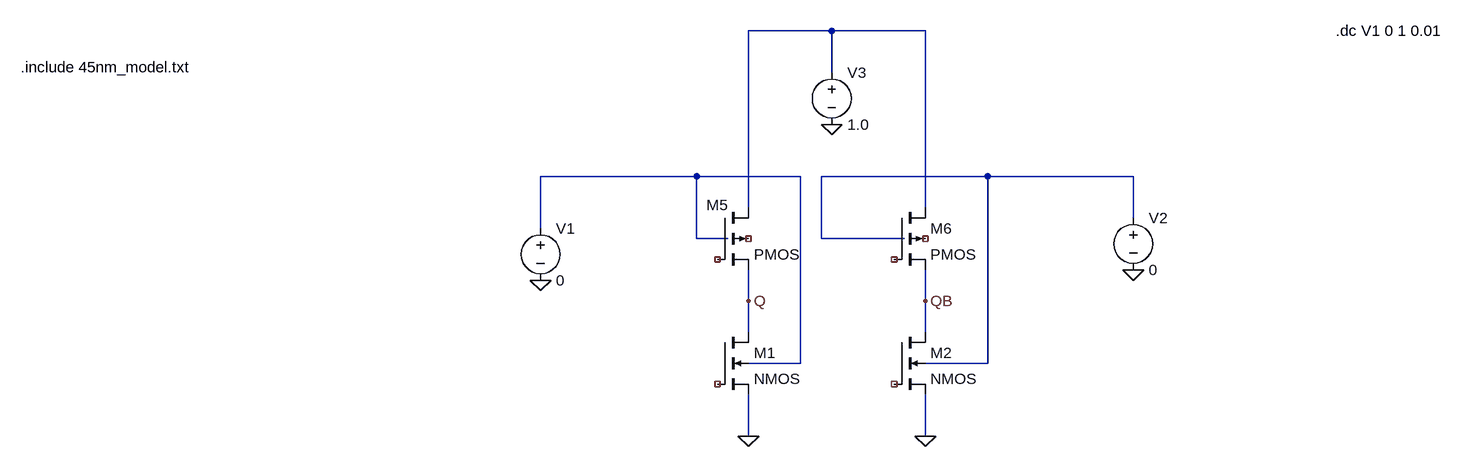
[diagram p0: schematic SRAM_Test.asc]
SRAM_Test.asc, the LTspice schematic file:
Version 4
SHEET 1 2196 912
WIRE 1024 -48 896 -48
WIRE 1168 -48 1024 -48
WIRE 1024 16 1024 -48
WIRE 816 176 576 176
WIRE 976 176 816 176
WIRE 1264 176 1008 176
WIRE 1488 176 1264 176
WIRE 896 224 896 -48
WIRE 1168 224 1168 -48
WIRE 1488 240 1488 176
WIRE 576 256 576 176
WIRE 816 272 816 176
WIRE 864 272 816 272
WIRE 1008 272 1008 176
WIRE 1136 272 1008 272
WIRE 896 368 896 320
WIRE 1168 368 1168 320
WIRE 896 416 896 368
WIRE 1168 416 1168 368
WIRE 976 464 976 176
WIRE 976 464 896 464
WIRE 1264 464 1264 176
WIRE 1264 464 1168 464
WIRE 896 576 896 512
WIRE 1168 576 1168 512
FLAG 896 368 Q
FLAG 1168 368 QB
FLAG 1024 96 0
FLAG 896 576 0
FLAG 1168 576 0
FLAG 576 336 0
FLAG 1488 320 0
SYMBOL nmos4 848 416 R0
SYMATTR InstName M1
SYMATTR Value2 l=45n w=240n
SYMBOL nmos4 1120 416 R0
SYMATTR InstName M2
SYMATTR Value2 l=45n w=240n
SYMBOL pmos4 848 224 R0
WINDOW 0 -17 -4 Left 2
SYMATTR InstName M5
SYMATTR Value2 l=45n w=120n
SYMBOL pmos4 1120 224 R0
SYMATTR InstName M6
SYMATTR Value2 l=45n w=120n
SYMBOL voltage 1024 0 R0
SYMATTR InstName V3
SYMATTR Value 1.0
SYMBOL voltage 576 240 R0
SYMATTR InstName V1
SYMATTR Value 0
SYMBOL voltage 1488 224 R0
SYMATTR InstName V2
SYMATTR Value 0
TEXT -224 8 Left 2 !.include 45nm_model.txt
TEXT 1800 -48 Left 2 !.dc V1 0 1 0.01

The netlist it stands for:
* SRAM_Test.asc
M1 Q NC_01 0 N002 NMOS l=45n w=240n
M2 QB NC_02 0 N003 NMOS l=45n w=240n
* M5: PMOS l=45n w=120n (symbol pmos4 not certain, pin order unknown); nets seen at it: N001, Q
* M6: PMOS l=45n w=120n (symbol pmos4 not certain, pin order unknown); nets seen at it: N001, QB
V3 N001 0 1.0
V1 N002 0 0
V2 N003 0 0
.model NMOS NMOS
.model PMOS PMOS
.lib standard.mos
.include 45nm_model.txt
.dc V1 0 1 0.01
.backanno
.end